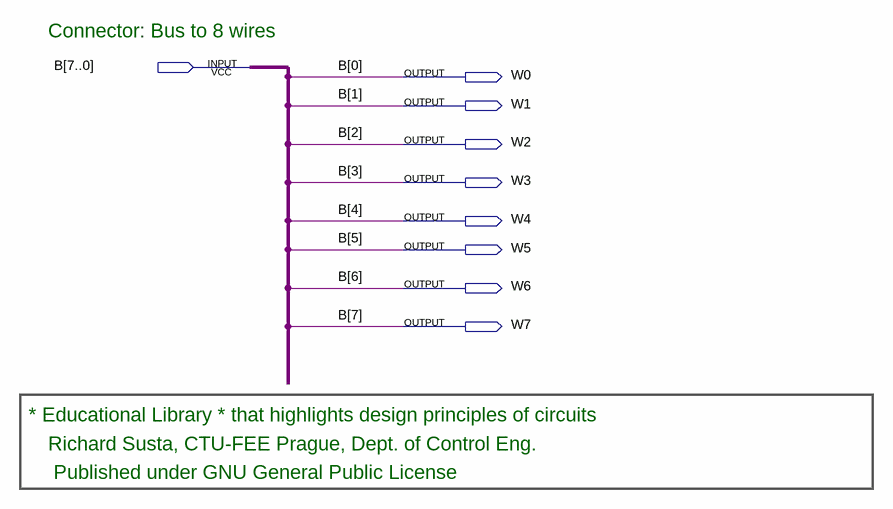
[diagram p0: schematic sheet]
// Quartus schematic split8bus.bdf as structural Verilog: 0 symbols, 9 pins
module split8bus (
  input  [7:0] B,
  output W0,
  output W1,
  output W2,
  output W3,
  output W4,
  output W5,
  output W6,
  output W7
);


  assign W0 = B[0];
  assign W1 = B[1];
  assign W2 = B[2];
  assign W3 = B[3];
  assign W4 = B[4];
  assign W5 = B[5];
  assign W6 = B[6];
  assign W7 = B[7];

  // Notes on the sheet:
  //   Connector: Bus to 8 wires
  //   * Educational Library * that highlights design principles of circuits
  //   Richard Susta, CTU-FEE Prague, Dept. of Control Eng. 
  //    Published under GNU General Public License
endmodule
